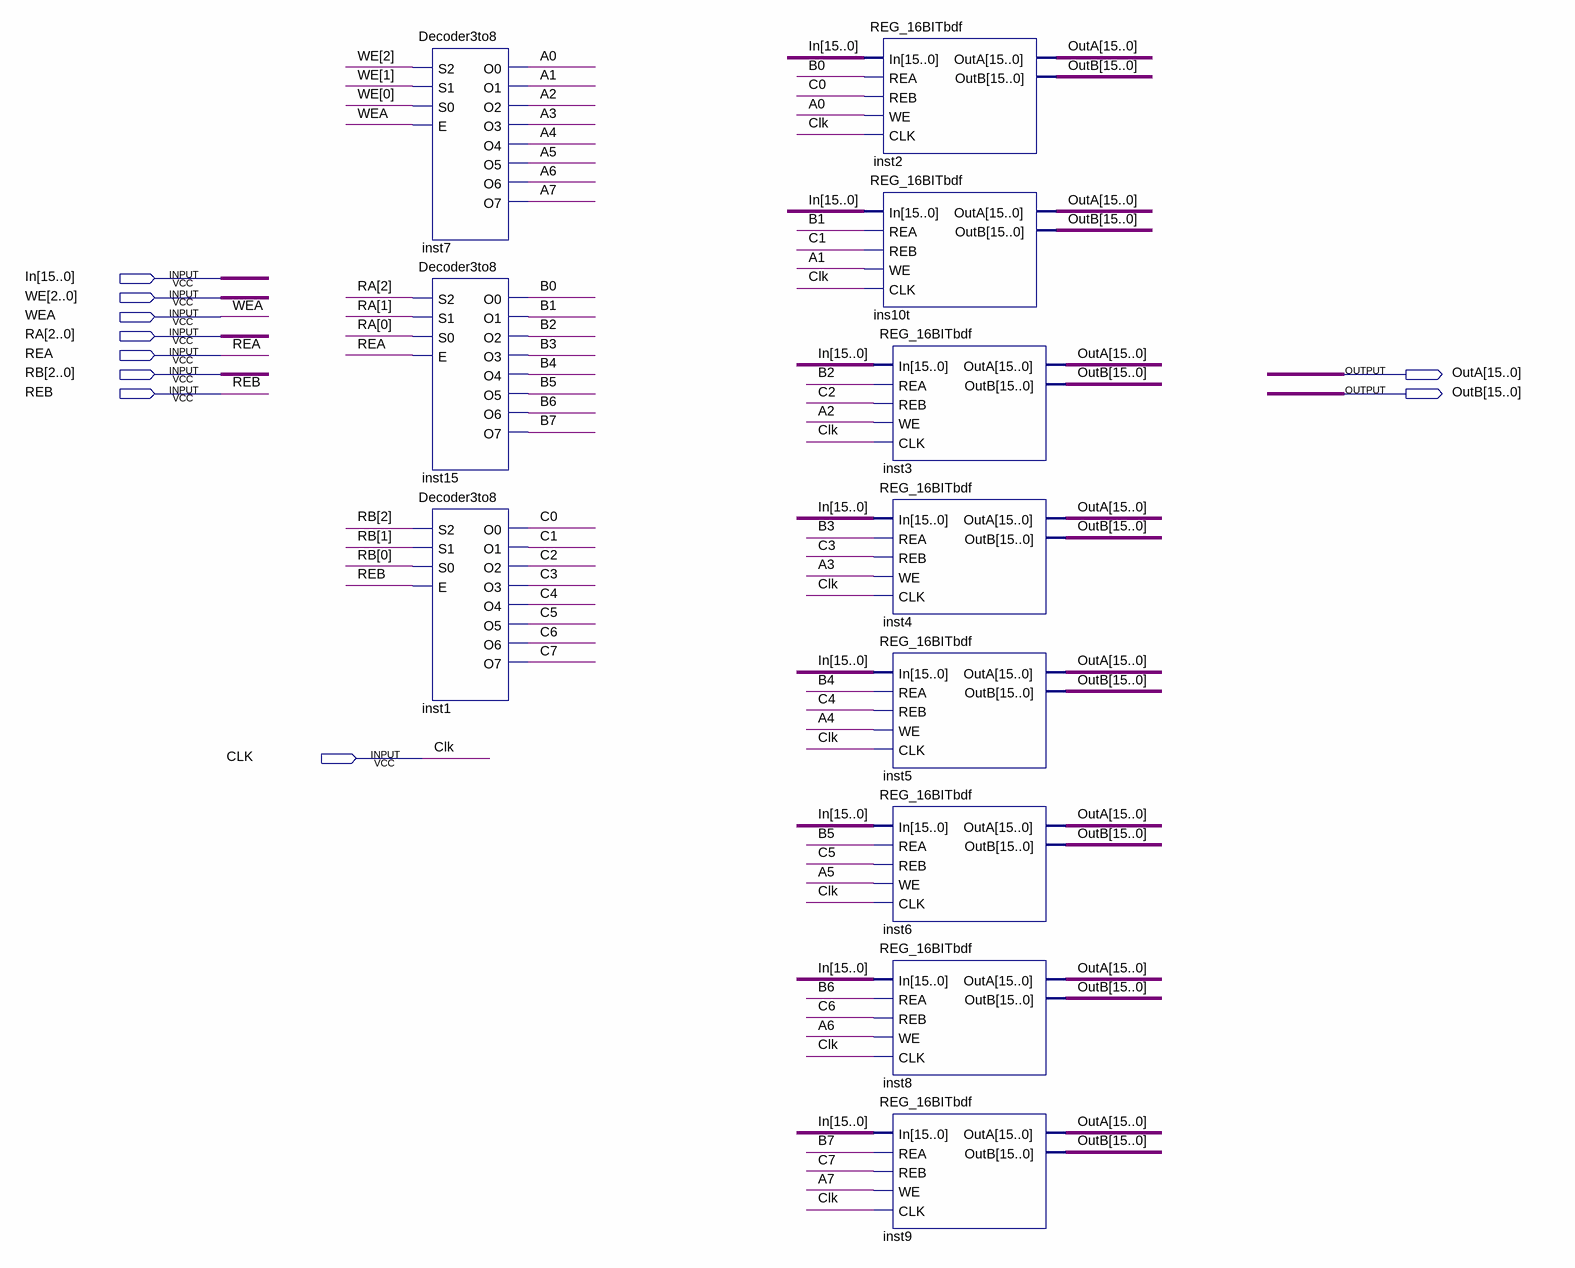
[diagram p0: schematic sheet]
// Quartus schematic Register_File_8Bank_16bit_Design.bdf as structural Verilog: 11 symbols, 10 pins
module Register_File_8Bank_16bit_Design (
  input  [15:0] In,
  input  [2:0] WE,
  input  WEA,
  input  [2:0] RA,
  input  REA,
  input  [2:0] RB,
  input  REB,
  input  CLK,
  output [15:0] OutA,
  output [15:0] OutB
);

  wire A0, A1, A2, A3, A4, A5, A6, A7, B0, B1, B2, B3, B4, B5, B6, B7, C0, C1, C2, C3, C4, C5, C6, C7;

  Decoder3to8 inst7 (
    .S2(WE[2]), .S1(WE[1]), .S0(WE[0]), .E(WEA), .O0(A0), .O1(A1), .O2(A2), .O3(A3), .O4(A4), .O5(A5),
    .O6(A6), .O7(A7));
  Decoder3to8 inst15 (
    .S2(RA[2]), .S1(RA[1]), .S0(RA[0]), .E(REA), .O0(B0), .O1(B1), .O2(B2), .O3(B3), .O4(B4), .O5(B5),
    .O6(B6), .O7(B7));
  Decoder3to8 inst1 (
    .S2(RB[2]), .S1(RB[1]), .S0(RB[0]), .E(REB), .O0(C0), .O1(C1), .O2(C2), .O3(C3), .O4(C4), .O5(C5),
    .O6(C6), .O7(C7));
  REG_16BITbdf inst2 (.In(In), .REA(B0), .REB(C0), .WE(A0), .CLK(CLK), .OutA(OutA), .OutB(OutB));
  REG_16BITbdf ins10t (.In(In), .REA(B1), .REB(C1), .WE(A1), .CLK(CLK), .OutA(OutA), .OutB(OutB));
  REG_16BITbdf inst3 (.In(In), .REA(B2), .REB(C2), .WE(A2), .CLK(CLK), .OutA(OutA), .OutB(OutB));
  REG_16BITbdf inst4 (.In(In), .REA(B3), .REB(C3), .WE(A3), .CLK(CLK), .OutA(OutA), .OutB(OutB));
  REG_16BITbdf inst5 (.In(In), .REA(B4), .REB(C4), .WE(A4), .CLK(CLK), .OutA(OutA), .OutB(OutB));
  REG_16BITbdf inst6 (.In(In), .REA(B5), .REB(C5), .WE(A5), .CLK(CLK), .OutA(OutA), .OutB(OutB));
  REG_16BITbdf inst8 (.In(In), .REA(B6), .REB(C6), .WE(A6), .CLK(CLK), .OutA(OutA), .OutB(OutB));
  REG_16BITbdf inst9 (.In(In), .REA(B7), .REB(C7), .WE(A7), .CLK(CLK), .OutA(OutA), .OutB(OutB));
endmodule
